# Altium project BlackPill(V1).PrjPcb
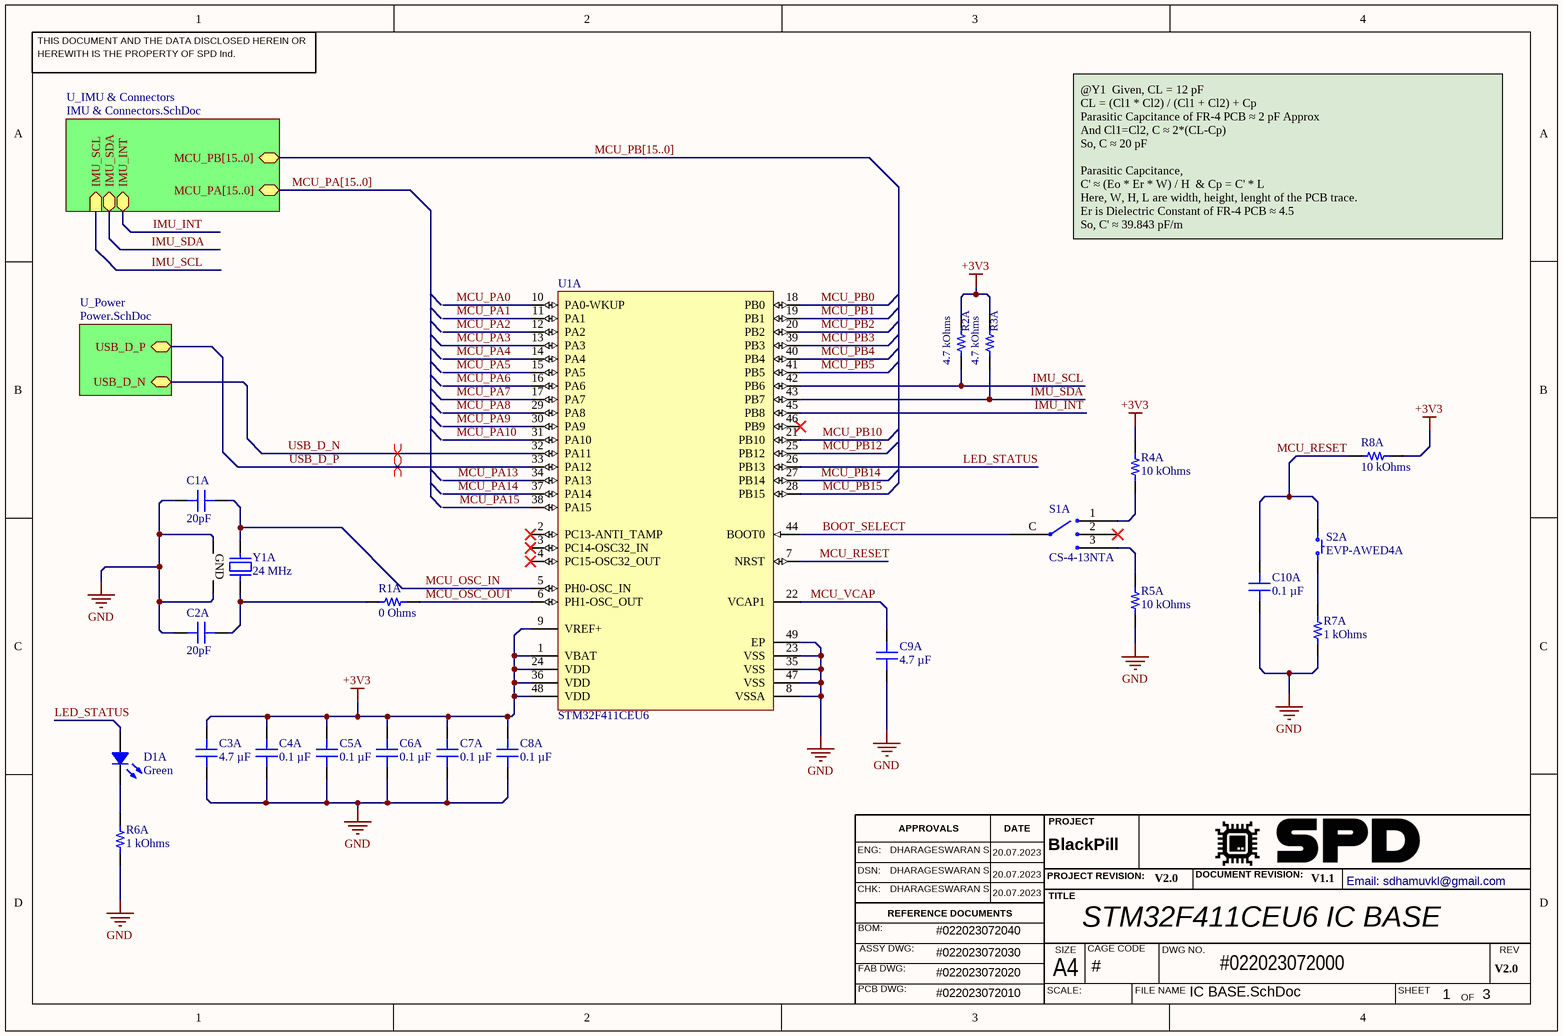
[diagram p0: IC BASE.SchDoc]
CAGE_CODE: #; Date: 20.07.2023; DOC_NO_ASSY_DWG: #022023072030; DOC_NO_BOM: #022023072040; DOC_NO_FAB_DWG: #022023072020; DOC_NO_SCH_DWG: #022023072000; DocumentRevision: V1.1; PCB_DWG_NO: #022023072010; Project: BlackPill; ProjectRevision: V2.0; Revision: V2.0
3 sheets, 44 parts. Net scope: hierarchical (ports join the sheet entries above them; power ports are global).
Board file: BlackPill.PcbDoc
Sheets:
  IC BASE.SchDoc
    U_Power = Power.SchDoc
    U_IMU & Connectors = IMU & Connectors.SchDoc

## Sheet IC BASE.SchDoc: STM32F411CEU6 IC BASE
size A4; ApprovedBy: DHARAGESWARAN S; CheckedBy: DHARAGESWARAN S; Author: DHARAGESWARAN S; CompanyName: SPD INDUSTRIES; DrawnBy: DHARAGESWARAN S; Engineer: DHARAGESWARAN S; Organization: SPD INDUSTRIES; SheetNumber: 1; SheetTotal: 3

### Parts
C1A  20pF  [CAP 0402_1005]
C2A  20pF  [CAP 0402_1005]
C3A  4.7 µF  [CAP 0402_1005]
C4A  0.1 µF  [CAP 0402_1005]
C5A  0.1 µF  [CAP 0402_1005]
C6A  0.1 µF  [CAP 0402_1005]
C7A  0.1 µF  [CAP 0402_1005]
C8A  0.1 µF  [CAP 0402_1005]
C9A  4.7 µF  [CAP 0402_1005]
C10A  0.1 µF  [CAP 0402_1005]
D1A  Green  [LED 0402_1005 GREEN]
R1A  0 Ohms  [RES 0402_1005]
R2A  4.7 kOhms  [RES 0402_1005]
R3A  4.7 kOhms  [RES 0402_1005]
R4A  10 kOhms  [RES 0402_1005]
R5A  10 kOhms  [RES 0402_1005]
R6A  1 kOhms  [RES 0402_1005]
R7A  1 kOhms  [RES 0402_1005]
R8A  10 kOhms  [RES 0402_1005]
S1A  CS-4-13NTA  [NIDEC COPAL CS-4-13NTA]
S2A  EVP-AWED4A  [PANASONIC EVPAW]
U1A  STM32F411CEU6  [STM-UFQFPN48_L]
Y1A  24 MHz  [EPSON TSX-3225]

### Sub-sheets
U_IMU & Connectors = IMU & Connectors.SchDoc: MCU_PA[15..0] (bidir), MCU_PB[15..0] (bidir), IMU_SCL (in), IMU_SDA (bidir), IMU_INT (bidir)
U_Power = Power.SchDoc: USB_D_N (bidir), USB_D_P (bidir)

### Nets
+3V3: C3A.2 C4A.2 C5A.2 C6A.2 C7A.2 C8A.2 R2A.2 R3A.2 R4A.2 R8A.1 U1A.1(VBAT) U1A.9(VREF+) U1A.24(VDD) U1A.36(VDD) U1A.48(VDD)
GND: C1A.1 C2A.1 C3A.1 C4A.1 C5A.1 C6A.1 C7A.1 C8A.1 C9A.1 C10A.1 R5A.1 R6A.1 R7A.1 U1A.8(VSSA) U1A.23(VSS) U1A.35(VSS) U1A.47(VSS) U1A.49(EP) Y1A.2(GND) Y1A.4(GND)
BOOT_SELECT: S1A.C U1A.44(BOOT0)
IMU_INT: U1A.45(PB8) ; sheet U_IMU & Connectors/IMU_INT
IMU_SCL: R2A.1 U1A.42(PB6) ; sheet U_IMU & Connectors/IMU_SCL
IMU_SDA: R3A.1 U1A.43(PB7) ; sheet U_IMU & Connectors/IMU_SDA
LED_STATUS: D1A.1 U1A.26(PB13)
MCU_OSC_IN: C1A.2 U1A.5(PH0-OSC_IN) Y1A.1
MCU_OSC_OUT: R1A.2 U1A.6(PH1-OSC_OUT)
MCU_PA0: U1A.10(PA0-WKUP)
MCU_PA1: U1A.11(PA1)
MCU_PA2: U1A.12(PA2)
MCU_PA3: U1A.13(PA3)
MCU_PA4: U1A.14(PA4)
MCU_PA5: U1A.15(PA5)
MCU_PA6: U1A.16(PA6)
MCU_PA7: U1A.17(PA7)
MCU_PA8: U1A.29(PA8)
MCU_PA9: U1A.30(PA9)
MCU_PA10: U1A.31(PA10)
MCU_PA13: U1A.34(PA13)
MCU_PA14: U1A.37(PA14)
MCU_PA15: U1A.38(PA15)
MCU_PB0: U1A.18(PB0)
MCU_PB1: U1A.19(PB1)
MCU_PB2: U1A.20(PB2)
MCU_PB3: U1A.39(PB3)
MCU_PB4: U1A.40(PB4)
MCU_PB5: U1A.41(PB5)
MCU_PB10: U1A.21(PB10)
MCU_PB12: U1A.25(PB12)
MCU_PB14: U1A.27(PB14)
MCU_PB15: U1A.28(PB15)
MCU_RESET: C10A.2 R8A.2 S2A.1 U1A.7(NRST)
MCU_VCAP: C9A.2 U1A.22(VCAP1)
USB_D_N: U1A.32(PA11) ; sheet U_Power/USB_D_N  [project net TVS_D_N]
USB_D_P: U1A.33(PA12) ; sheet U_Power/USB_D_P  [project net TVS_D_P]
NetC2A_2: C2A.2 R1A.1 Y1A.3
NetD1A_2: D1A.2 R6A.2
NetR4A_1: R4A.1 S1A.1
NetR5A_2: R5A.2 S1A.3
NetR7A_2: R7A.2 S2A.2

Not connected (* = marked no-connect by the designer): S1A 2*; U1A 2(PC13-ANTI_TAMP)* 3(PC14-OSC32_IN)* 4(PC15-OSC32_OUT)* 46(PB9)*

### Buses and harness runs
bus MCU_PA[15..0] = sheet U_IMU & Connectors/MCU_PA[15..0]
bus MCU_PB[15..0] = sheet U_IMU & Connectors/MCU_PB[15..0]

### Layout directives
differential pair: TVS_D_N, TVS_D_P

### Notes on the sheet
- @Y1  Given, CL = 12 pF
  CL = (Cl1 * Cl2) / (Cl1 + Cl2) + Cp
  Parasitic Capcitance of FR-4 PCB ≈ 2 pF Approx
  And Cl1=Cl2, C ≈ 2*(CL-Cp)
  So, C ≈ 20 pF
  Parasitic Capcitance,
  C' ≈ (Eo * Er * W) / H  & Cp = C' * L
  Here, W, H, L are width, height, lenght of the PCB trace.
  Er is Dielectric Constant of FR-4 PCB ≈ 4.5
  So, C' ≈ 39.843 pF/m
- THIS DOCUMENT AND THE DATA DISCLOSED HEREIN OR
- HEREWITH IS THE PROPERTY OF SPD Ind.
- ENG:
- DHARAGESWARAN S
- APPROVALS
- DATE
- PROJECT
- DSN:
- CHK:
- REFERENCE DOCUMENTS
- PROJECT REVISION:
- TITLE
- DOCUMENT REVISION:
- Email: sdhamuvkl@gmail.com <https://github.com/DhamuVkl>
- BOM:
- FAB DWG:
- PCB DWG:
- ASSY DWG:
- SCALE:
- A4
- SIZE
- CAGE CODE
- FILE NAME
- DWG NO.
- SHEET
- REV
- OF

### Library data of the parts
C1A C2A = 04023U200JAT2A: CAP CER 20PF 25V NP0 0402; Manufacturer: AVX Corporation; id: 68; Temperature Coefficient: C0G, NP0; Tolerance: ±5%; Part Number: 04023U200JAT2A; Value: 20pF; Supplier Part Number 1: 478-11758-1-ND; ComponentLink2Description: DigiKey Link; Features: Ultra Low ESR; ComponentLink1URL: http://datasheets.avx.com/U-Series.pdf; PartId: 1805; Supplier 1: DigiKey; Series: U; LastUpdated: 2022-02-08T12:26:58.317; Part Status: Active; Capacitance: 20pF; Device Package: 0402 (1005 Metric); Thickness (Max): 0.022" (0.55mm); Voltage - Rated: 25V; Minimum Order: 1; Packaging: TapeAndReel; Applications: RF, Microwave, High Frequency; Package / Case: 0402 (1005 Metric); ComponentLink1Description: Datasheet; Price: 0.02; ComponentLink2URL: http://digikey.com/product-detail/en/avx-corporation/04023U200JAT2A/478-11758-1-ND/8573394; Lifecycle Status: Active; Operating Temperature: -55°C ~ 125°C; Size / Dimension: 0.039" L x 0.020" W (1.00mm x 0.50mm); Mounting Type: Surface Mount, MLCC
C3A C9A = GMC04X5R475K10NT: CAP0402 X5R 4.7UF 10% 10V; Manufacturer: Cal-Chip Electronics, Inc.; id: 6422; Part Number: GMC04X5R475K10NT; Value: 4.7 µF; Temperature Coefficient: X5R; Supplier Part Number 1: 4713-GMC04X5R475K10NTCT-ND; ComponentLink2Description: DigiKey Link; ComponentLink1URL: https://88ce57.p3cdn1.secureserver.net/wp-content/uploads/2023/01/gmc_series-2.pdf; PartId: 49814; Tolerance: ±10%; Supplier 1: DigiKey; Series: GMC; LastUpdated: 2023-04-21T19:03:30.743; Part Status: Active; Capacitance: 4.7 µF; Device Package: 0402 (1005 Metric); Thickness (Max): 0.028" (0.70mm); Voltage - Rated: 10V; Minimum Order: 1; Packaging: TapeAndReel; Applications: General Purpose; Package / Case: 0402 (1005 Metric); ComponentLink1Description: Datasheet; Price: 0.01; ComponentLink2URL: https://www.digikey.com/en/products/detail/cal-chip-electronics-inc/GMC04X5R475K10NT/18151135; Lifecycle Status: Active; Operating Temperature: -55°C ~ 85°C; Size / Dimension: 0.039" L x 0.020" W (1.00mm x 0.50mm); Mounting Type: Surface Mount, MLCC
C4A C5A C6A C7A C8A C10A = CL05B104KP5VPNC: CAP CER 100NF 10V X7R 0402; Manufacturer: Samsung Electro-Mechanics; id: 7736; Tolerance: ±10%; Part Number: CL05B104KP5VPNC; Value: 0.1 µF; Temperature Coefficient: X7R; Supplier Part Number 1: 1276-CL05B104KP5VPNCCT-ND; ComponentLink2Description: DigiKey Link; ComponentLink1URL: https://mm.digikey.com/Volume0/opasdata/d220001/medias/docus/5458/CL05B104KP5VPNC_Spec.pdf; PartId: 56690; Supplier 1: DigiKey; Series: CL; LastUpdated: 2023-11-05T20:02:55.743; Capacitance: 0.1 µF; Device Package: 0402 (1005 Metric); Ratings: AEC-Q200; Thickness (Max): 0.022" (0.55mm); Voltage - Rated: 10V; Minimum Order: 1; Packaging: TapeAndReel; Applications: Automotive; Package / Case: 0402 (1005 Metric); ComponentLink1Description: Datasheet; Price: 0.01; ComponentLink2URL: https://www.digikey.com/en/products/detail/samsung-electro-mechanics/CL05B104KP5VPNC/20498482; Lifecycle Status: Active; Operating Temperature: -55°C ~ 125°C; Size / Dimension: 0.039" L x 0.020" W (1.00mm x 0.50mm); Mounting Type: Surface Mount, MLCC
D1A = HSMG-C280: LED GREEN DIFFUSED 0402 SMD; Manufacturer: Broadcom Limited; id: 697; Lens Color: White; Wavelength - Peak: 570nm; Lens Style: Rectangle with Flat Top; Viewing Angle: 130°; Lens Size: 1.00mm x 0.50mm; Configuration: Standard; Wavelength - Dominant: 572nm; Voltage - Forward (Vf) (Typ): 2.2V; Current - Test: 20mA; Millicandela Rating: 15mcd; Part Number: HSMG-C280; Supplier Part Number 1: 516-3066-1-ND; Lens Transparency: Diffused; Supplier Device Package: 0402; ComponentLink1Description: Datasheet; Color: Green; ComponentLink2URL: https://www.digikey.com/en/products/detail/broadcom-limited/HSMG-C280/1235358; ComponentLink1URL: https://docs.broadcom.com/docs/AV02-0602EN; Supplier 1: DigiKey; Series: -; Height (Max): 0.40mm; Part Status: Active; ComponentLink2Description: DigiKey Link; Device Package: 0402 (1005 Metric); Packaging: TapeAndReel; Minimum Order: 1; Package / Case: 0402 (1005 Metric); PartId: 697; Lifecycle Status: Active; LastUpdated: 2023-01-02T20:56:26.750; Value: Green; Size / Dimension: 1.00mm L x 0.50mm W; Mounting Type: Surface Mount; Price: 0.08
R1A = AC0402JR-070RL: RES SMD 0 OHM JUMPER 1/16W 0402; Manufacturer: Yageo; id: 9339; Power (Watts): 0.063W, 1/16W; Part Number: AC0402JR-070RL; Height - Seated (Max): 0.015" (0.37mm); Supplier Part Number 1: 311-0.0LBCT-ND; Supplier Device Package: 0402; ComponentLink1Description: Datasheet; ComponentLink2URL: https://www.digikey.com/en/products/detail/yageo/AC0402JR-070RL/2827807; Features: Automotive AEC-Q200, Moisture Resistant; ComponentLink1URL: https://www.yageo.com/upload/media/product/productsearch/datasheet/rchip/PYu-AC_51_RoHS_L_7.pdf; Composition: Thick Film; Tolerance: Jumper; Supplier 1: DigiKey; Series: AC; Part Status: Active; ComponentLink2Description: DigiKey Link; Device Package: 0402 (1005 Metric); Packaging: CutTape; Ratings: AEC-Q200; Minimum Order: 1; Package / Case: 0402 (1005 Metric); PartId: 20617; Lifecycle Status: Active; LastUpdated: 2023-01-02T20:20:32.243; Operating Temperature: -55°C ~ 155°C; Number Of Terminations: 2; Value: 0 Ohms; Size / Dimension: 0.039" L x 0.020" W (1.00mm x 0.50mm); Price: 0.01; Resistance: 0 Ohms
R2A R3A = AC0402FR-074K7L: RES SMD 4.7K OHM 1% 1/16W 0402; Manufacturer: Yageo; id: 4996; Temperature Coefficient: ±100ppm/°C; Power (Watts): 0.063W, 1/16W; Part Number: AC0402FR-074K7L; Height - Seated (Max): 0.015" (0.37mm); Supplier Part Number 1: YAG3497CT-ND; Supplier Device Package: 0402; ComponentLink1Description: Datasheet; ComponentLink2URL: https://www.digikey.com/en/products/detail/yageo/AC0402FR-074K7L/5895396; Features: Automotive AEC-Q200, Moisture Resistant; ComponentLink1URL: https://www.yageo.com/upload/media/product/productsearch/datasheet/rchip/PYu-AC_51_RoHS_L_7.pdf; Composition: Thick Film; Tolerance: ±1%; Supplier 1: DigiKey; Series: AC; Part Status: Active; ComponentLink2Description: DigiKey Link; Device Package: 0402 (1005 Metric); Packaging: CutTape; Ratings: AEC-Q200; Minimum Order: 1; Package / Case: 0402 (1005 Metric); PartId: 12051; Lifecycle Status: Active; LastUpdated: 2023-01-02T20:21:09.847; Operating Temperature: -55°C ~ 155°C; Number Of Terminations: 2; Value: 4.7 kOhms; Size / Dimension: 0.039" L x 0.020" W (1.00mm x 0.50mm); Price: 0.01; Resistance: 4.7 kOhms
R4A R5A R8A = AA0402FR-0710KL: RES SMD 10K OHM 1% 1/16W 0402; Manufacturer: Yageo; id: 10610; Temperature Coefficient: ±150ppm/°C; Power (Watts): 0.063W, 1/16W; Part Number: AA0402FR-0710KL; Height - Seated (Max): 0.015" (0.37mm); Supplier Part Number 1: 13-AA0402FR-0710KLCT-ND; Supplier Device Package: 0402; ComponentLink1Description: Datasheet; ComponentLink2URL: https://www.digikey.com/en/products/detail/yageo/AA0402FR-0710KL/5887729; Features: Anti-Sulfur, Automotive AEC-Q200, Moisture Resistant; ComponentLink1URL: https://www.yageo.com/upload/media/product/productsearch/datasheet/rchip/PYu-AA_51_RoHS_L_3.pdf; Composition: Thick Film; Tolerance: ±1%; Supplier 1: DigiKey; Series: AA; Part Status: Active; ComponentLink2Description: DigiKey Link; Device Package: 0402 (1005 Metric); Packaging: TapeAndReel; Ratings: AEC-Q200; Minimum Order: 1; Package / Case: 0402 (1005 Metric); PartId: 59190; Lifecycle Status: Active; LastUpdated: 2023-01-02T20:20:10.303; Operating Temperature: -55°C ~ 155°C; Number Of Terminations: 2; Value: 10 kOhms; Size / Dimension: 0.039" L x 0.020" W (1.00mm x 0.50mm); Price: 0.01; Resistance: 10 kOhms
R6A R7A = AA0402FR-071KL: RES SMD 1K OHM 1% 1/16W 0402; Manufacturer: Yageo; id: 10598; Temperature Coefficient: ±150ppm/°C; Power (Watts): 0.063W, 1/16W; Part Number: AA0402FR-071KL; Height - Seated (Max): 0.015" (0.37mm); Supplier Part Number 1: 13-AA0402FR-071KLCT-ND; Supplier Device Package: 0402; ComponentLink1Description: Datasheet; ComponentLink2URL: https://www.digikey.com/en/products/detail/yageo/AA0402FR-071KL/5887878; Features: Anti-Sulfur, Automotive AEC-Q200, Moisture Resistant; ComponentLink1URL: https://www.yageo.com/upload/media/product/productsearch/datasheet/rchip/PYu-AA_51_RoHS_L_3.pdf; Composition: Thick Film; Tolerance: ±1%; Supplier 1: DigiKey; Series: AA; Part Status: Active; ComponentLink2Description: DigiKey Link; Device Package: 0402 (1005 Metric); Packaging: TapeAndReel; Ratings: AEC-Q200; Minimum Order: 1; Package / Case: 0402 (1005 Metric); PartId: 59178; Lifecycle Status: Active; LastUpdated: 2023-01-02T20:20:10.210; Operating Temperature: -55°C ~ 155°C; Number Of Terminations: 2; Value: 1 kOhms; Size / Dimension: 0.039" L x 0.020" W (1.00mm x 0.50mm); Price: 0.01; Resistance: 1 kOhms
S1A = CS-4-13NTA: SWITCH ROTARY DIP SP3T 100MA 16V; Manufacturer: Nidec Copal Electronics; id: 6; Actuator Level: Flush, Recessed; Number Of Positions: 3; Washable: Yes; Pitch: 0.051" (1.30mm); Actuator Type: Rotary for Tool; Part Number: CS-4-13NTA; Height Above Board: 0.091" (2.30mm); Supplier Part Number 1: 563-1035-1-ND; Current Rating (Amps): 100mA; ComponentLink1Description: Datasheet; Contact Material: Copper Alloy; ComponentLink2URL: https://www.digikey.com/en/products/detail/nidec-copal-electronics/CS-4-13NTA/948346; ComponentLink1URL: https://www.nidec-copal-electronics.com/e/catalog/switch/cs-4.pdf; Supplier 1: DigiKey; Series: CS-4; Part Status: Active; ComponentLink2Description: DigiKey Link; Packaging: TapeAndReel; Minimum Order: 1; Contact Finish: Gold; PartId: 13; Lifecycle Status: Active; LastUpdated: 2022-09-26T03:19:43.077; Termination Style: J Lead; Operating Temperature: -25°C ~ 70°C; Circuit: SP3T; Mounting Type: Surface Mount; Price: 0.93
S2A = EVP-AWED4A: 3.0MM X 2.0MM / 3.3N / 0.15MM ST; Manufacturer: Panasonic Electronic Components; id: 5; Switch Function: Off-Mom; Contact Rating @ Voltage: 0.02A @ 15VDC; Outline: 3.00mm x 2.00mm; Actuator Height Off Pcb, Vertical: 0.60mm; Ingress Protection: IP67 - Dust Tight, Waterproof; Actuator Orientation: Top Actuated; Actuator Type: Standard; Illumination: Non-Illuminated; Operating Force: 330gf; Circuit: SPST-NO; Part Number: EVP-AWED4A; Supplier Part Number 1: P123440CT-ND; ComponentLink1Description: Datasheet; ComponentLink2URL: https://www.digikey.com/en/products/detail/panasonic-electronic-components/EVP-AWED4A/8568275; ComponentLink1URL: https://industrial.panasonic.com/ac/cdn/e/control/switch/light-touch/catalog/sw_lt_eng_3020s.pdf; Supplier 1: DigiKey; Series: EVPAW; Part Status: Active; ComponentLink2Description: DigiKey Link; Packaging: TapeAndReel; Minimum Order: 1; Lifecycle Status: Active; LastUpdated: 2023-01-02T21:07:29.980; Termination Style: SMD (SMT) Tab; Operating Temperature: -40°C ~ 85°C; Mounting Type: Surface Mount; Price: 0.16
U1A = CMP-0243-00165-1: ARM Cortex-M4 32-bit MCU+FPU, 512 KB Flash, 128 KB RAM, 36 I/Os, 48-Pin UFQFPN, -40 to 85 degC, Tray; Operating Frequency(F) (Processor speed) (MHz): 100; FLASH Size (Prog) (kB): 512; Internal RAM Size (kB): 128; I/Os (High Current): 36; Supply Voltage(Vcc) min (V): 1.7; Package Reference: 48-Pin Ultra Thin Fine Pitch Quad Flat No-Lead, 7 x 7 x 0.6 mm Body, 0.5 mm Pitch, Exposed Pad; ComponentLink1Description: Manufacturer URL; ComponentLink1URL: http://www.st.com/; Packing: Tray; Package Description: UFQFPN48; Core: ARM Cortex-M4; ComponentLink2Description: Datasheet; ComponentLink2URL: http://www.st.com/st-web-ui/static/active/en/resource/technical/document/datasheet/DM00115249.pdf; DatasheetVersion: Rev. 6; Mounting Technology: Surface Mount
Y1A = TSX-3225 24.0000MF15X-AC3: CRYSTAL 24.0000MHZ 9PF SMD; Manufacturer: EPSON; id: 441; Frequency Tolerance: ±10ppm; Frequency Stability: ±15ppm; Operating Mode: Fundamental; Esr (Equivalent Series Resistance): 40 Ohms; Part Number: TSX-3225 24.0000MF15X-AC3; Height - Seated (Max): 0.024" (0.60mm); Supplier Part Number 1: SER3635CT-ND; ComponentLink1Description: Datasheet; ComponentLink2URL: https://www.digikey.com/en/products/detail/epson/TSX-3225-24-0000MF15X-AC3/1825444; ComponentLink1URL: https://support.epson.biz/td/api/doc_check.php?dl=brief_TSX-3225&lang=en; Supplier 1: DigiKey; Frequency: 24 MHz; Series: TSX-3225; Part Status: Active; Type: MHz Crystal; ComponentLink2Description: DigiKey Link; Packaging: TapeAndReel; Minimum Order: 1; Package / Case: 4-SMD, No Lead; PartId: 441; Lifecycle Status: Active; LastUpdated: 2023-01-02T20:58:19.840; Operating Temperature: -40°C ~ 85°C; Value: 24 MHz; Size / Dimension: 0.126" L x 0.098" W (3.20mm x 2.50mm); Mounting Type: Surface Mount; Price: 0.44; Load Capacitance: 9pF

## Sheet Power.SchDoc: POWER MANAGEMENT
size A4; Date: *******; ApprovedBy: *******; CheckedBy: DHARAGESWARAN S; Author: *******; CompanyName: *******; DrawnBy: DHARAGESWARAN S; Engineer: *******; Organization: *******; Address1: *******; Address2: *******; Address3: *******; Address4: *******; DocumentNumber: Doc Num; Revision: *******; SheetNumber: 3; SheetTotal: 3; CurrentTime: *******; CurrentDate: *******; Time: *******; DocumentFullPathAndName: *******; DocumentName: *******; ModifiedDate: *******; ImagePath: *******; ProjectName: *******; Application_BuildNumber: *******
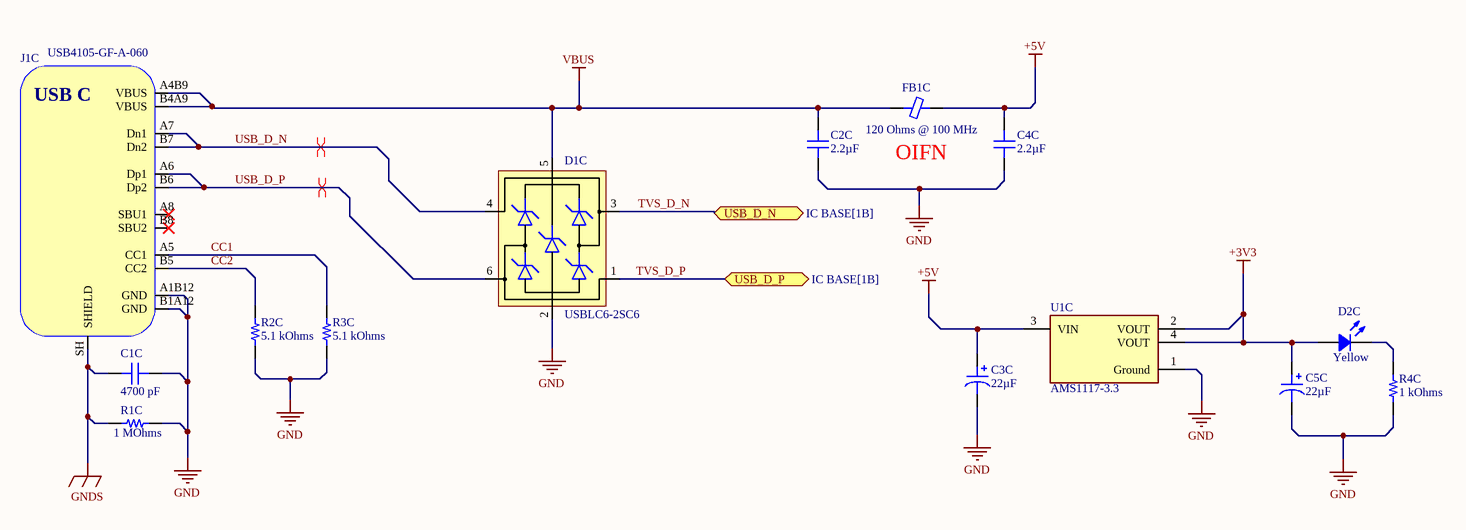
[diagram p1: Power.SchDoc]

### Parts
C1C  4700 pF  [CAP 0402_1005]
C2C  2.2µF  [CAP 0402_1005]
C3C  22µF  [CAP POL 1411_3528]
C4C  2.2µF  [CAP 0402_1005]
C5C  22µF  [CAP POL 1411_3528]
D1C  USBLC6-2SC6  [SOT-23-6]
D2C  Yellow  [LED 0402_1005 YELLOW]
FB1C  120 Ohms @ 100 MHz  [FER 0603_1608]
J1C  USB4105-GF-A-060  [USB4105-GF-A-060]
R1C  1 MOhms  [RES 0402_1005]
R2C  5.1 kOhms  [RES 0402_1005]
R3C  5.1 kOhms  [RES 0402_1005]
R4C  1 kOhms  [RES 0402_1005]
U1C  AMS1117-3.3  [FP-AMS1117-IPC_C]

### Ports
USB_D_N (bidir, see IC BASE[1B]), USB_D_P (bidir, see IC BASE[1B])

### Nets
+3V3: C5C.1 D2C.1 U1C.2(VOUT) U1C.4(VOUT)
+5V: C3C.1 C4C.2 FB1C.2 U1C.3(VIN)
GND: C1C.2 C2C.1 C3C.2 C4C.1 C5C.2 D1C.2(GND) J1C.A1B12(GND) J1C.B1A12(GND) R1C.2 R2C.1 R3C.1 R4C.1 U1C.1(Ground)
GNDS: C1C.1 J1C.SH(SHIELD) R1C.1
VBUS: C2C.2 D1C.5(VBUS) FB1C.1 J1C.A4B9(VBUS) J1C.B4A9(VBUS)
CC1: J1C.A5(CC1) R3C.2
CC2: J1C.B5(CC2) R2C.2
TVS_D_N: D1C.3(IO2) ; port USB_D_N
TVS_D_P: D1C.1(IO1) ; port USB_D_P
USB_D_N: D1C.4(IO2) J1C.A7(Dn1) J1C.B7(Dn2)
USB_D_P: D1C.6(IO1) J1C.A6(Dp1) J1C.B6(Dp2)
NetD2C_2: D2C.2 R4C.2

Not connected (* = marked no-connect by the designer): J1C A8(SBU1)* B8(SBU2)*

### Layout directives
differential pair: USB_D_N, USB_D_P

### Notes on the sheet
- (near FB1C) OIFN
- THIS DOCUMENT AND THE DATA DISCLOSED HEREIN OR
- HEREWITH IS THE PROPERTY OF SPD Ind.
- ENG:
- DHARAGESWARAN S
- APPROVALS
- DATE
- PROJECT
- DSN:
- CHK:
- REFERENCE DOCUMENTS
- PROJECT REVISION:
- TITLE
- DOCUMENT REVISION:
- Email: sdhamuvkl@gmail.com <https://github.com/DhamuVkl>
- BOM:
- FAB DWG:
- PCB DWG:
- ASSY DWG:
- SCALE:
- A4
- SIZE
- CAGE CODE
- FILE NAME
- DWG NO.
- SHEET
- REV
- OF
- (in symbol USB4105-GF-A-060) USB C

### Library data of the parts
C1C = C0402C472K4RECAUTO: CAP CER 0402 4.7NF 16V X7R 10%; Manufacturer: KEMET; id: 3032; Part Number: C0402C472K4RECAUTO; Value: 4700 pF; Temperature Coefficient: X7R; Supplier Part Number 1: 399-17875-1-ND; ComponentLink2Description: DigiKey Link; ComponentLink1URL: https://api.kemet.com/component-edge/download/datasheet/C0402C472K4RECAUTO.pdf; PartId: 12122; Tolerance: ±10%; Supplier 1: DigiKey; Series: ESD SMD Auto X7R; LastUpdated: 2023-01-03T20:03:46.940; Part Status: Active; Capacitance: 4700 pF; Device Package: 0402 (1005 Metric); Ratings: AEC-Q200; Thickness (Max): 0.022" (0.55mm); Voltage - Rated: 16V; Minimum Order: 1; Packaging: TapeAndReel; Applications: Automotive, ESD Protection; Package / Case: 0402 (1005 Metric); ComponentLink1Description: Datasheet; Price: 0.01; ComponentLink2URL: https://www.digikey.com/en/products/detail/kemet/C0402C472K4RECAUTO/8640469; Lifecycle Status: Active; Operating Temperature: -55°C ~ 125°C; Size / Dimension: 0.039" L x 0.020" W (1.00mm x 0.50mm); Mounting Type: Surface Mount, MLCC
C2C C4C = 0402ZD225KAT2A: CAP CER 2.2UF 10V X5R 0402; Manufacturer: AVX Corporation; id: 2335; Tolerance: ±10%; Part Number: 0402ZD225KAT2A; Value: 2.2µF; Temperature Coefficient: X5R; Supplier Part Number 1: 478-10072-1-ND; ComponentLink2Description: DigiKey Link; ComponentLink1URL: http://datasheets.avx.com/cx5r.pdf; PartId: 9346; Supplier 1: DigiKey; Series: -; LastUpdated: 2022-02-08T12:26:45.707; Part Status: Active; Capacitance: 2.2µF; Device Package: 0402 (1005 Metric); Thickness (Max): 0.022" (0.56mm); Voltage - Rated: 10V; Minimum Order: 1; Packaging: TapeAndReel; Applications: General Purpose; Package / Case: 0402 (1005 Metric); ComponentLink1Description: Datasheet; Price: 0.09; ComponentLink2URL: http://digikey.com/product-detail/en/avx-corporation/0402ZD225KAT2A/478-10072-1-ND/6564294; Lifecycle Status: Active; Operating Temperature: -55°C ~ 85°C; Size / Dimension: 0.039" L x 0.020" W (1.00mm x 0.50mm); Mounting Type: Surface Mount, MLCC
C3C C5C = T540B226K010CH86107610: CAP TANT POLY 22UF 10V 1411; Manufacturer: KEMET; Manufacturer Size Code: B; id: 2514; Tolerance: ±10%; Type: Molded; Ratings: COTS; Lifetime @ Temp.: 2000 Hrs @ 125°C; Esr (Equivalent Series Resistance): 80mOhm @ 100kHz; Part Number: T540B226K010CH86107610; Value: 22µF; Height - Seated (Max): 0.083" (2.10mm); Supplier Part Number 1: T540B226K010CH86107610-ND; ComponentLink2Description: DigiKey Link; Features: High Reliability; ComponentLink1URL: https://api.kemet.com/component-edge/download/datasheet/T540B226K010CH86107610.pdf; PartId: 2514; Supplier 1: DigiKey; Series: KO-CAP® T540; LastUpdated: 2020-08-30T20:56:14.177; Capacitance: 22µF; Voltage - Rated: 10V; Minimum Order: 3600; Packaging: Bulk; Package / Case: 1411 (3528 Metric); ComponentLink1Description: Datasheet; Price: 9.10; ComponentLink2URL: http://digikey.com/product-detail/en/kemet/T540B226K010CH86107610/T540B226K010CH86107610-ND/6676110; Lifecycle Status: Active; Operating Temperature: -55°C ~ 125°C; Size / Dimension: 0.138" L x 0.110" W (3.50mm x 2.80mm); Mounting Type: Surface Mount
D1C = USBLC6-2SC6: Low-Capacitance ESD Protection USB; Manufacturer: STMicroelectronics; Manufacturer Part Number: USBLC6-2SC6; Distributor Link: https://www.mouser.de/ProductDetail/STMicroelectronics/USBLC6-2SC6?qs=po45yt2pPpu%2FhNIlwQdTlg%3D%3D
D2C = SM0402YC: LED YELLOW CLEAR 0402 SMD; Manufacturer: Bivar Inc.; id: 170; Lens Color: Colorless; Wavelength - Peak: 593nm; Lens Style: Rectangle with Flat Top; Viewing Angle: 130°; Lens Size: 0.50mm x 1.00mm; Configuration: 0402; Wavelength - Dominant: 592nm; Voltage - Forward (Vf) (Typ): 2V; Current - Test: 20mA; Millicandela Rating: 145mcd; Part Number: SM0402YC; Supplier Part Number 1: 492-2206-1-ND; Lens Transparency: Clear; Supplier Device Package: 0402; ComponentLink1Description: Datasheet; Color: Yellow; ComponentLink2URL: https://www.digikey.com/en/products/detail/bivar-inc/SM0402YC/6810862; ComponentLink1URL: https://www.bivar.com/Files/Datasheets/SM0402YC.pdf; Supplier 1: DigiKey; Series: -; Height (Max): 0.71mm; Part Status: Active; ComponentLink2Description: DigiKey Link; Device Package: 0402 (1005 Metric); Packaging: TapeAndReel; Minimum Order: 1; Package / Case: 0402 (1005 Metric); PartId: 170; Lifecycle Status: Active; LastUpdated: 2023-01-02T20:57:30.187; Value: Yellow; Size / Dimension: 1.00mm L x 0.50mm W; Mounting Type: Surface Mount; Price: 0.16
FB1C = BLM18KG121TZ1D: FERRITE BEAD 120 OHM 0603 1LN; Manufacturer: Murata Electronics; id: 635; DC Resistance (DCR) (Max): 30mOhm; Number Of Lines: 1; Filter Type: Power Line; Current Rating (Max): 3A; Part Number: BLM18KG121TZ1D; Supplier Part Number 1: 490-16500-1-ND; ComponentLink1Description: Datasheet; ComponentLink2URL: https://www.digikey.com/en/products/detail/murata-electronics/BLM18KG121TZ1D/7363244; ComponentLink1URL: https://www.murata.com/en-us/products/productdata/8796750610462/QNFA9122.pdf; Supplier 1: DigiKey; Series: EMIFIL®, BLM18; Height (Max): 0.030" (0.75mm); Part Status: Active; ComponentLink2Description: DigiKey Link; Device Package: 0603 (1608 Metric); Impedance @ Frequency: 120 Ohms @ 100 MHz; Packaging: TapeAndReel; Ratings: AEC-Q200; Minimum Order: 1; Package / Case: 0603 (1608 Metric); PartId: 635; Lifecycle Status: Active; LastUpdated: 2023-01-02T20:51:43.247; Operating Temperature: -55°C ~ 125°C; Value: 120 Ohms @ 100 MHz; Size / Dimension: 0.063" L x 0.032" W (1.60mm x 0.80mm); Mounting Type: Surface Mount; Price: 0.02
J1C = USB4105-GF-A-060: USB Connector Type C SMT 12 Pin; Manufacturer: GCT; Manufacturer Part Number: USB4105-GF-A-060; Distributor Link: https://eu.mouser.com/ProductDetail/GCT/USB4105-GF-A-060?qs=QNEnbhJQKvY2mocwNJzgfA%3D%3D
R1C = AC0402FR-071ML: RES SMD 1M OHM 1% 1/16W 0402; Manufacturer: Yageo; id: 4991; Temperature Coefficient: ±100ppm/°C; Power (Watts): 0.063W, 1/16W; Part Number: AC0402FR-071ML; Height - Seated (Max): 0.015" (0.37mm); Supplier Part Number 1: YAG3450CT-ND; Supplier Device Package: 0402; ComponentLink1Description: Datasheet; ComponentLink2URL: https://www.digikey.com/en/products/detail/yageo/AC0402FR-071ML/5895164; Features: Automotive AEC-Q200, Moisture Resistant; ComponentLink1URL: https://www.yageo.com/upload/media/product/productsearch/datasheet/rchip/PYu-AC_51_RoHS_L_7.pdf; Composition: Thick Film; Tolerance: ±1%; Supplier 1: DigiKey; Series: AC; Part Status: Active; ComponentLink2Description: DigiKey Link; Device Package: 0402 (1005 Metric); Packaging: CutTape; Ratings: AEC-Q200; Minimum Order: 1; Package / Case: 0402 (1005 Metric); PartId: 12043; Lifecycle Status: Active; LastUpdated: 2023-01-02T20:21:09.883; Operating Temperature: -55°C ~ 155°C; Number Of Terminations: 2; Value: 1 MOhms; Size / Dimension: 0.039" L x 0.020" W (1.00mm x 0.50mm); Price: 0.01; Resistance: 1 MOhms
R2C R3C = AC0402FR-075K1L: RES SMD 5.1K OHM 1% 1/16W 0402; Manufacturer: Yageo; id: 5028; Temperature Coefficient: ±100ppm/°C; Power (Watts): 0.063W, 1/16W; Part Number: AC0402FR-075K1L; Height - Seated (Max): 0.015" (0.37mm); Supplier Part Number 1: YAG3503CT-ND; Supplier Device Package: 0402; ComponentLink1Description: Datasheet; ComponentLink2URL: https://www.digikey.com/en/products/detail/yageo/AC0402FR-075K1L/5895438; Features: Automotive AEC-Q200, Moisture Resistant; ComponentLink1URL: https://www.yageo.com/upload/media/product/productsearch/datasheet/rchip/PYu-AC_51_RoHS_L_7.pdf; Composition: Thick Film; Tolerance: ±1%; Supplier 1: DigiKey; Series: AC; Part Status: Active; ComponentLink2Description: DigiKey Link; Device Package: 0402 (1005 Metric); Packaging: CutTape; Ratings: AEC-Q200; Minimum Order: 1; Package / Case: 0402 (1005 Metric); PartId: 12111; Lifecycle Status: Active; LastUpdated: 2023-01-02T20:21:09.567; Operating Temperature: -55°C ~ 155°C; Number Of Terminations: 2; Value: 5.1 kOhms; Size / Dimension: 0.039" L x 0.020" W (1.00mm x 0.50mm); Price: 0.01; Resistance: 5.1 kOhms
R4C = AA0402FR-071KL: as R6A on sheet IC BASE; Part Number: AA0402FR-071KL; Height - Seated (Max): 0.015" (0.37mm); Supplier Part Number 1: 13-AA0402FR-071KLCT-ND; Supplier Device Package: 0402; ComponentLink1Description: Datasheet; ComponentLink2URL: https://www.digikey.com/en/products/detail/yageo/AA0402FR-071KL/5887878; Features: Anti-Sulfur, Automotive AEC-Q200, Moisture Resistant; ComponentLink1URL: https://www.yageo.com/upload/media/product/productsearch/datasheet/rchip/PYu-AA_51_RoHS_L_3.pdf; Composition: Thick Film; Tolerance: ±1%; Supplier 1: DigiKey; Series: AA; Part Status: Active; ComponentLink2Description: DigiKey Link; Device Package: 0402 (1005 Metric); Packaging: TapeAndReel; Ratings: AEC-Q200; Minimum Order: 1; Package / Case: 0402 (1005 Metric); PartId: 59178; Lifecycle Status: Active; LastUpdated: 2023-01-02T20:20:10.210; Operating Temperature: -55°C ~ 155°C; Number Of Terminations: 2; Value: 1 kOhms; Size / Dimension: 0.039" L x 0.020" W (1.00mm x 0.50mm); Price: 0.01; Resistance: 1 kOhms
U1C = CMP-209535-000001-1: LDO Voltage Regulators 1A, 3.3V; Manufacturer: Advanced Monolithic Systems; Dropout Voltage: 1.1V; Output Type: Fixed; Nominal Supply Current: 5mA; Max Power Dissipation: 1.2W; Max Supply Voltage: 15V; Number Of Outputs: 1; Standoff Height: 0.64mm; Max Junction Temp: +125°C; Height: 1.8mm; Package: AMS1117; Device Class L2: Power Management ICs; ComponentLink2Description: Datasheet; ComponentLink2URL: http://www.advanced-monolithic.com/pdf/ds1117.pdf; Category: IC; RoHS: TRUE; Automotive: No; Device Class L1: Integrated Circuits (ICs); Output Current: 1A; Device Class L3: Voltage Regulators - Linear; Temperature: -40°C to +125°C; Output Voltage: 3.3V; Manufacturer Part Number: AMS1117-3.3; Temperature Range Low: -40°C; Octopart: https://octopart.com/ams1117-3.3-advanced+monolithic+systems-25899300; Lead Free: Yes; Ipc Land Pattern Name: SOT229P700X180-4; Temperature Range High: +125°C

## Sheet IMU & Connectors.SchDoc: IMU UNIT & PORTS
size 193 x 292 mm; ApprovedBy: DHARAGESWARAN S; CheckedBy: DHARAGESWARAN S; Author: DHARAGESWARAN S; CompanyName: SPD INDUSTRIES; DrawnBy: DHARAGESWARAN S; Engineer: DHARAGESWARAN S; Organization: SPD INDUSTRIES; SheetNumber: 2; SheetTotal: 3
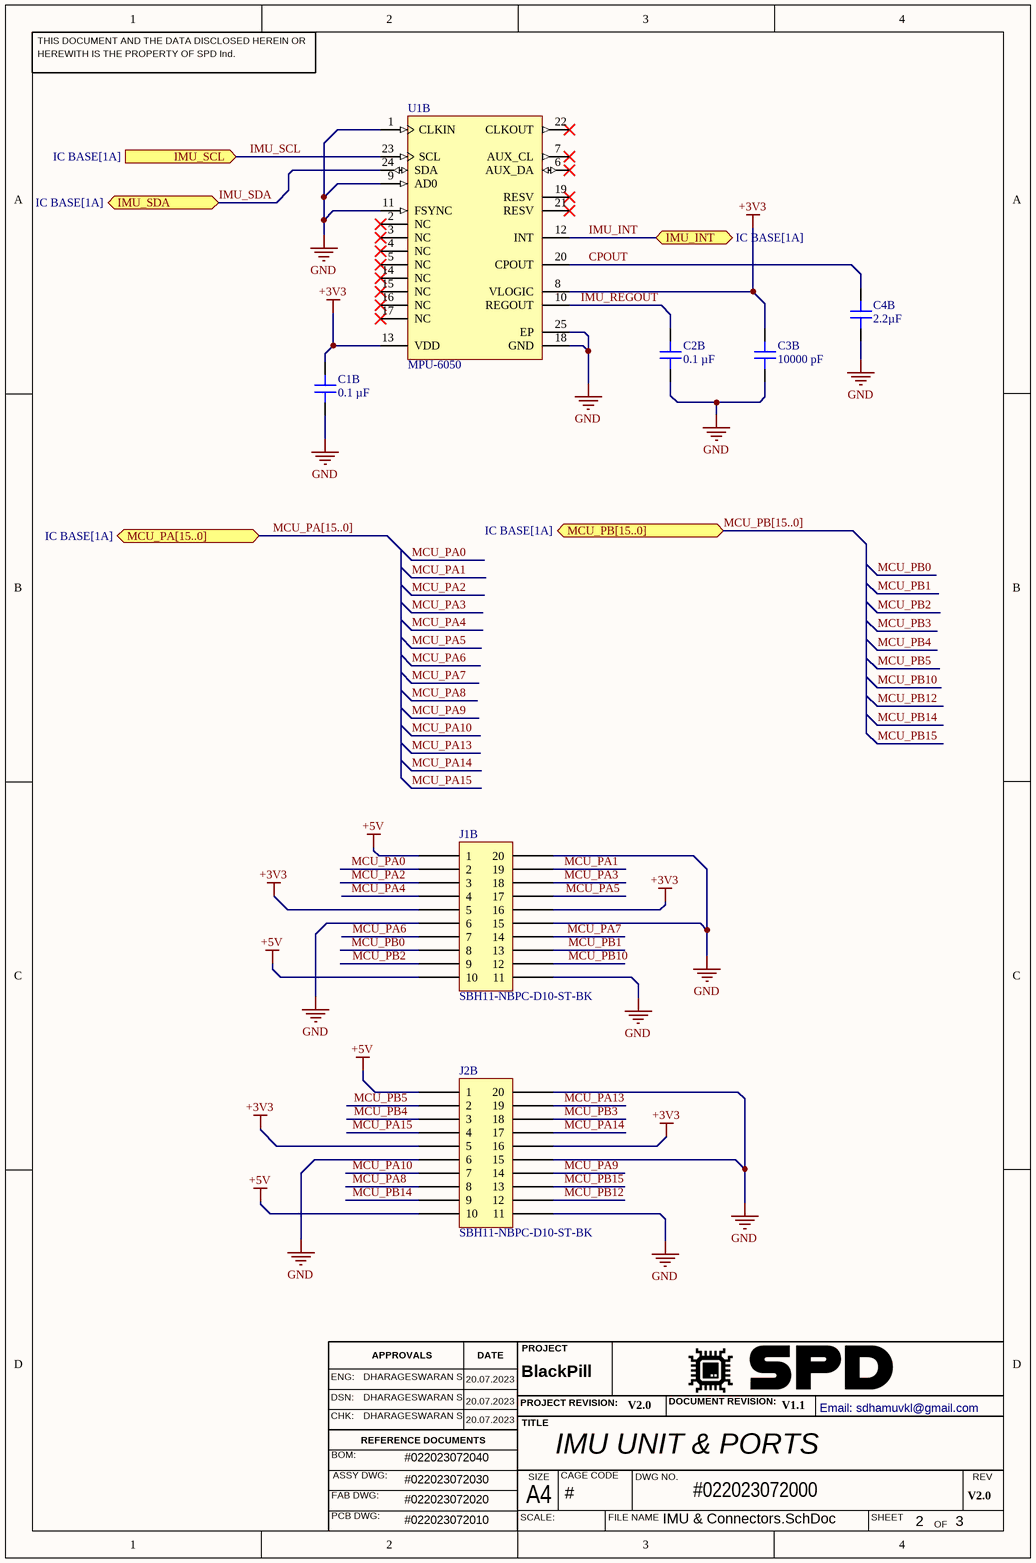
[diagram p2: IMU & Connectors.SchDoc]

### Parts
C1B  0.1 µF  [CAP 0402_1005]
C2B  0.1 µF  [CAP 0402_1005]
C3B  10000 pF  [CAP 0402_1005]
C4B  2.2µF  [CAP 0402_1005]
J1B  SBH11-NBPC-D10-ST-BK  [SULLINS SBH11-NBPC-D10-ST-BK]
J2B  SBH11-NBPC-D10-ST-BK  [SULLINS SBH11-NBPC-D10-ST-BK]
U1B  MPU-6050  [QFN50P400X400X95-24N]

### Ports
IMU_INT (bidir, see IC BASE[1A]), IMU_SCL (in, see IC BASE[1A]), IMU_SDA (bidir, see IC BASE[1A]), MCU_PA[15..0] (bidir, see IC BASE[1A]), MCU_PB[15..0] (bidir, see IC BASE[1A])

### Nets
+3V3: C1B.2 C3B.2 J1B.5 J1B.16 J2B.5 J2B.16 U1B.8(VLOGIC) U1B.13(VDD)
+5V: J1B.1 J1B.10 J2B.1 J2B.10
GND: C1B.1 C2B.1 C3B.1 C4B.1 J1B.6 J1B.11 J1B.15 J1B.20 J2B.6 J2B.11 J2B.15 J2B.20 U1B.1(CLKIN) U1B.9(AD0) U1B.11(FSYNC) U1B.18(GND) U1B.25(EP)
CPOUT: C4B.2 U1B.20(CPOUT)
IMU_INT: U1B.12(INT) ; port IMU_INT
IMU_REGOUT: C2B.2 U1B.10(REGOUT)
IMU_SCL: U1B.23(SCL) ; port IMU_SCL
IMU_SDA: U1B.24(SDA) ; port IMU_SDA
MCU_PA0: J1B.2
MCU_PA1: J1B.19
MCU_PA2: J1B.3
MCU_PA3: J1B.18
MCU_PA4: J1B.4
MCU_PA5: J1B.17
MCU_PA6: J1B.7
MCU_PA7: J1B.14
MCU_PA8: J2B.8
MCU_PA9: J2B.14
MCU_PA10: J2B.7
MCU_PA13: J2B.19
MCU_PA14: J2B.17
MCU_PA15: J2B.4
MCU_PB0: J1B.8
MCU_PB1: J1B.13
MCU_PB2: J1B.9
MCU_PB3: J2B.18
MCU_PB4: J2B.3
MCU_PB5: J2B.2
MCU_PB10: J1B.12
MCU_PB12: J2B.12
MCU_PB14: J2B.9
MCU_PB15: J2B.13

Not connected (* = marked no-connect by the designer): U1B 2(NC)* 3(NC)* 4(NC)* 5(NC)* 6(AUX_DA)* 7(AUX_CL)* 14(NC)* 15(NC)* 16(NC)* 17(NC)* 19(RESV)* 21(RESV)* 22(CLKOUT)*

### Buses and harness runs
bus MCU_PA[15..0] = port MCU_PA[15..0]
bus MCU_PB[15..0] = port MCU_PB[15..0]

### Notes on the sheet
- THIS DOCUMENT AND THE DATA DISCLOSED HEREIN OR
- HEREWITH IS THE PROPERTY OF SPD Ind.
- ENG:
- DHARAGESWARAN S
- APPROVALS
- DATE
- PROJECT
- DSN:
- CHK:
- REFERENCE DOCUMENTS
- PROJECT REVISION:
- TITLE
- DOCUMENT REVISION:
- Email: sdhamuvkl@gmail.com <https://github.com/DhamuVkl>
- BOM:
- FAB DWG:
- PCB DWG:
- ASSY DWG:
- SCALE:
- A4
- SIZE
- CAGE CODE
- FILE NAME
- DWG NO.
- SHEET
- REV
- OF

### Library data of the parts
C1B C2B = CL05B104KP5VPNC: as C4A on sheet IC BASE; Part Number: CL05B104KP5VPNC; Value: 0.1 µF; Temperature Coefficient: X7R; Supplier Part Number 1: 1276-CL05B104KP5VPNCCT-ND; ComponentLink2Description: DigiKey Link; ComponentLink1URL: https://mm.digikey.com/Volume0/opasdata/d220001/medias/docus/5458/CL05B104KP5VPNC_Spec.pdf; PartId: 56690; Supplier 1: DigiKey; Series: CL; LastUpdated: 2023-11-05T20:02:55.743; Capacitance: 0.1 µF; Device Package: 0402 (1005 Metric); Ratings: AEC-Q200; Thickness (Max): 0.022" (0.55mm); Voltage - Rated: 10V; Minimum Order: 1; Packaging: TapeAndReel; Applications: Automotive; Package / Case: 0402 (1005 Metric); ComponentLink1Description: Datasheet; Price: 0.01; ComponentLink2URL: https://www.digikey.com/en/products/detail/samsung-electro-mechanics/CL05B104KP5VPNC/20498482; Lifecycle Status: Active; Operating Temperature: -55°C ~ 125°C; Size / Dimension: 0.039" L x 0.020" W (1.00mm x 0.50mm); Mounting Type: Surface Mount, MLCC
C3B = C0402C103K4REC7411: CAP CER 0402 10NF 16V X7R 10%; Manufacturer: KEMET; id: 7587; Part Number: C0402C103K4REC7411; Value: 10000 pF; Temperature Coefficient: X7R; Supplier Part Number 1: 399-C0402C103K4REC7411CT-ND; ComponentLink2Description: DigiKey Link; ComponentLink1URL: https://connect.kemet.com:7667/gateway/IntelliData-ComponentDocumentation/1.0/download/datasheet/C0402C103K4REC7411; PartId: 56100; Tolerance: ±10%; Supplier 1: DigiKey; Series: ESD SMD Comm X7R; LastUpdated: 2023-08-20T19:02:59.890; Capacitance: 10000 pF; Device Package: 0402 (1005 Metric); Thickness (Max): 0.022" (0.55mm); Voltage - Rated: 16V; Minimum Order: 1; Packaging: TapeAndReel; Applications: ESD Protection; Package / Case: 0402 (1005 Metric); ComponentLink1Description: Datasheet; Price: 0.01; ComponentLink2URL: https://www.digikey.com/en/products/detail/kemet/C0402C103K4REC7411/8645017; Lifecycle Status: Active; Operating Temperature: -55°C ~ 125°C; Size / Dimension: 0.039" L x 0.020" W (1.00mm x 0.50mm); Mounting Type: Surface Mount, MLCC
C4B = 0402ZD225KAT2A: as C2C on sheet Power; Part Number: 0402ZD225KAT2A; Value: 2.2µF; Temperature Coefficient: X5R; Supplier Part Number 1: 478-10072-1-ND; ComponentLink2Description: DigiKey Link; ComponentLink1URL: http://datasheets.avx.com/cx5r.pdf; PartId: 9346; Supplier 1: DigiKey; Series: -; LastUpdated: 2022-02-08T12:26:45.707; Part Status: Active; Capacitance: 2.2µF; Device Package: 0402 (1005 Metric); Thickness (Max): 0.022" (0.56mm); Voltage - Rated: 10V; Minimum Order: 1; Packaging: TapeAndReel; Applications: General Purpose; Package / Case: 0402 (1005 Metric); ComponentLink1Description: Datasheet; Price: 0.09; ComponentLink2URL: http://digikey.com/product-detail/en/avx-corporation/0402ZD225KAT2A/478-10072-1-ND/6564294; Lifecycle Status: Active; Operating Temperature: -55°C ~ 85°C; Size / Dimension: 0.039" L x 0.020" W (1.00mm x 0.50mm); Mounting Type: Surface Mount, MLCC
J1B J2B = SBH11-NBPC-D10-ST-BK: CONN HEADER VERT 20POS 2.54MM; Manufacturer: Sullins Connector Solutions; id: 135; Style: Board to Board or Cable; Current Rating (Amps): 3A; Number Of Positions: 20; Number Of Positions Loaded: All; Shrouding: Shrouded - 4 Wall; Material Flammability Rating: UL94 V-0; Part Number: SBH11-NBPC-D10-ST-BK; Supplier Part Number 1: SBH11-NBPC-D10-ST-BK-ND; Contact Shape: Square; Termination: Solder; ComponentLink1Description: Datasheet; Connector Type: Header; Contact Material: Brass; ComponentLink2URL: http://digikey.com/product-detail/en/sullins-connector-solutions/SBH11-NBPC-D10-ST-BK/SBH11-NBPC-D10-ST-BK-ND/4558585; Contact Finish - Mating: Gold; Features: Keying Slot; ComponentLink1URL: https://s3.amazonaws.com/catalogspreads-pdf/PAGE122%20.100%20SBH11%20SERIES%20MALE%20BOX%20HDR%20ST%20RA%20SMT.pdf; Fastening Type: Push-Pull; Supplier 1: DigiKey; Number Of Rows: 2; Series: SBH11; Part Status: Active; ComponentLink2Description: DigiKey Link; Contact Type: Male Pin; Packaging: Tray; Contact Finish - Post: Gold; Contact Finish Thickness - Mating: Flash; Minimum Order: 1000; PartId: 135; Lifecycle Status: Active; LastUpdated: 2022-06-21T14:45:11.303; Operating Temperature: -40°C ~ 105°C; Insulation Color: Black; Mounting Type: Through Hole; Insulation Material: Polyamide (PA), Nylon; Price: 0.40
U1B = MPU-6050: MPU-6050 series Accelerometer, Gyroscope, 3 Axis Sensor Evaluation Board; MF: TDK InvenSense; SnapEDA_Link: https://www.snapeda.com/parts/MPU-6050/TDK+InvenSense/view-part/?ref=snap; Package: QFN-24 InvenSense; Value: *; MP: MPU-6050; Check_prices: https://www.snapeda.com/parts/MPU-6050/TDK+InvenSense/view-part/?ref=eda; Supplier 1: Digikey; Supplier Part Number 1: 1428-1007-1-ND

## Nets that join several sheets
+3V3: IC BASE (15 pins), Power (C5C.1 D2C.1 U1C.2 U1C.4), IMU & Connectors (8 pins)
+5V: Power (C3C.1 C4C.2 FB1C.2 U1C.3), IMU & Connectors (J1B.1 J1B.10 J2B.1 J2B.10)
GND: IC BASE (20 pins), Power (13 pins), IMU & Connectors (17 pins)
IMU_INT: IC BASE (U1A.45), IMU & Connectors (U1B.12)
IMU_SCL: IC BASE (R2A.1 U1A.42), IMU & Connectors (U1B.23)
IMU_SDA: IC BASE (R3A.1 U1A.43), IMU & Connectors (U1B.24)
MCU_PA0: IC BASE (U1A.10), IMU & Connectors (J1B.2)
MCU_PA1: IC BASE (U1A.11), IMU & Connectors (J1B.19)
MCU_PA2: IC BASE (U1A.12), IMU & Connectors (J1B.3)
MCU_PA3: IC BASE (U1A.13), IMU & Connectors (J1B.18)
MCU_PA4: IC BASE (U1A.14), IMU & Connectors (J1B.4)
MCU_PA5: IC BASE (U1A.15), IMU & Connectors (J1B.17)
MCU_PA6: IC BASE (U1A.16), IMU & Connectors (J1B.7)
MCU_PA7: IC BASE (U1A.17), IMU & Connectors (J1B.14)
MCU_PA8: IC BASE (U1A.29), IMU & Connectors (J2B.8)
MCU_PA9: IC BASE (U1A.30), IMU & Connectors (J2B.14)
MCU_PA10: IC BASE (U1A.31), IMU & Connectors (J2B.7)
MCU_PA13: IC BASE (U1A.34), IMU & Connectors (J2B.19)
MCU_PA14: IC BASE (U1A.37), IMU & Connectors (J2B.17)
MCU_PA15: IC BASE (U1A.38), IMU & Connectors (J2B.4)
MCU_PB0: IC BASE (U1A.18), IMU & Connectors (J1B.8)
MCU_PB1: IC BASE (U1A.19), IMU & Connectors (J1B.13)
MCU_PB2: IC BASE (U1A.20), IMU & Connectors (J1B.9)
MCU_PB3: IC BASE (U1A.39), IMU & Connectors (J2B.18)
MCU_PB4: IC BASE (U1A.40), IMU & Connectors (J2B.3)
MCU_PB5: IC BASE (U1A.41), IMU & Connectors (J2B.2)
MCU_PB10: IC BASE (U1A.21), IMU & Connectors (J1B.12)
MCU_PB12: IC BASE (U1A.25), IMU & Connectors (J2B.12)
MCU_PB14: IC BASE (U1A.27), IMU & Connectors (J2B.9)
MCU_PB15: IC BASE (U1A.28), IMU & Connectors (J2B.13)
TVS_D_N: IC BASE (U1A.32), Power (D1C.3)
TVS_D_P: IC BASE (U1A.33), Power (D1C.1)